# EAGLE design digital (EAGLE 7.6.0)
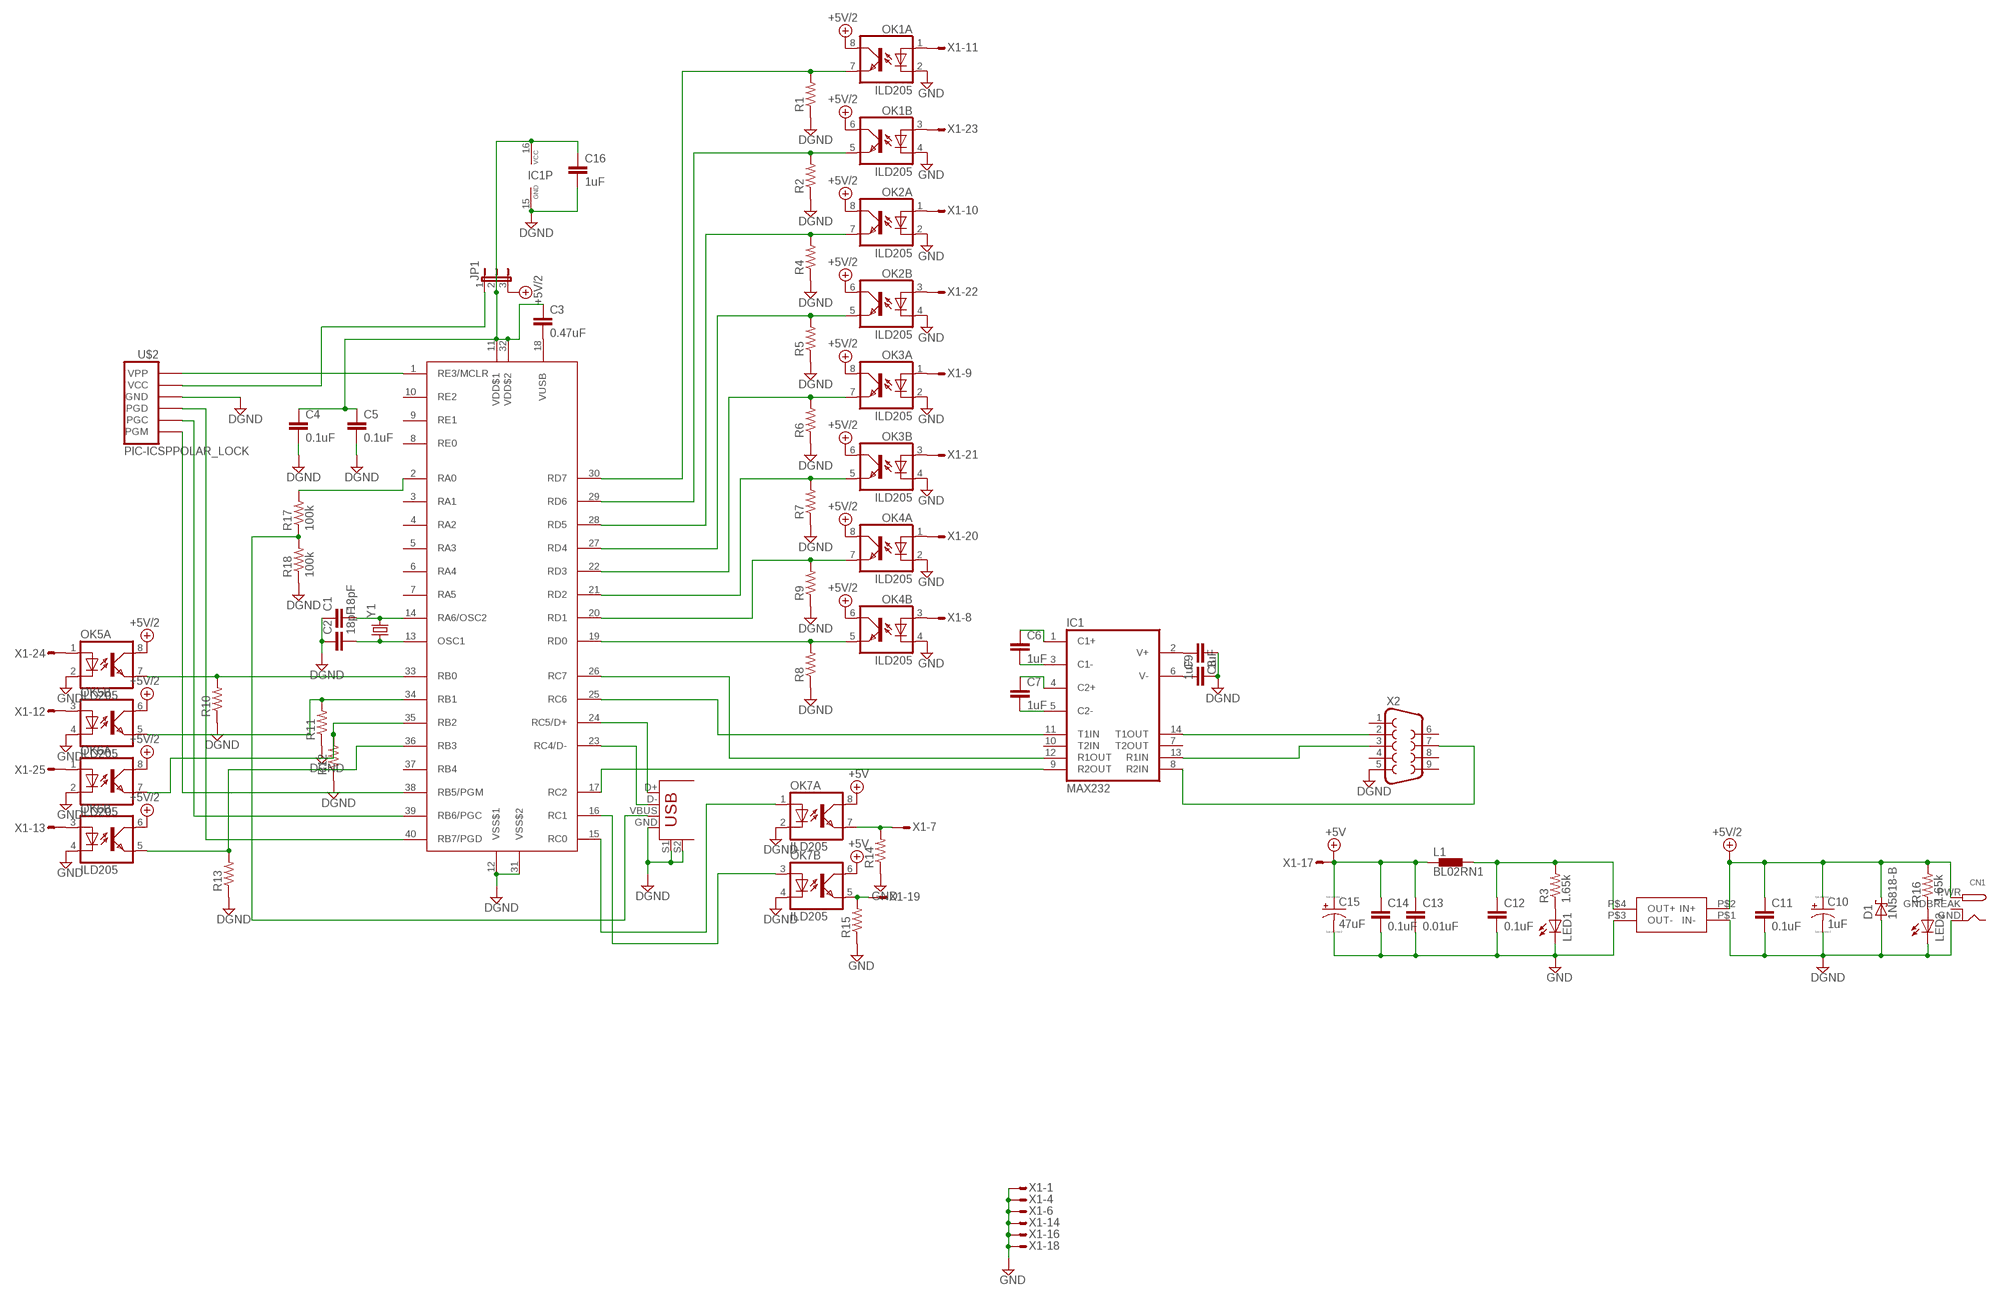
[diagram p0: schematic, sheet 1]

## Parts
C1  18pF  C-EU050-025X075  [C050-025X075]
C2  18pF  C-EU050-025X075  [C050-025X075]
C3  0.47uF  C-EU050-025X075  [C050-025X075]
C4  0.1uF  C-EU050-025X075  [C050-025X075]
C5  0.1uF  C-EU050-025X075  [C050-025X075]
C6  1uF  C-EU050-025X075  [C050-025X075]
C7  1uF  C-EU050-025X075  [C050-025X075]
C8  1uF  C-EU050-025X075  [C050-025X075]
C9  1uF  C-EU050-025X075  [C050-025X075]
C10  1uF  CPOL-USE5-8.5  [E5-8,5]
C11  0.1uF  C-EU050-025X075  [C050-025X075]
C12  0.1uF  C-EU050-025X075  [C050-025X075]
C13  0.01uF  C-EU050-025X075  [C050-025X075]
C14  0.1uF  C-EU050-025X075  [C050-025X075]
C15  47uF  CPOL-USE5-8.5  [E5-8,5]
C16  1uF  C-EU050-025X075  [C050-025X075]
CN1  DCBARRELPTH  [DCJACK_2MM_PTH]
D1  1N5818-B  [DO41-7.6]
IC1  MAX232  [DIL16]
J1  USB+SHIELD  [USB-B-PTH]
JP1  JP2E  [JP2]
L1  BL02RN1  [BL02RN1]
LED1  LED3MM  [LED3MM]
LED2  LED3MM  [LED3MM]
OK1  ILD205  [SOIC08]
OK2  ILD205  [SOIC08]
OK3  ILD205  [SOIC08]
OK4  ILD205  [SOIC08]
OK5  ILD205  [SOIC08]
OK6  ILD205  [SOIC08]
OK7  ILD205  [SOIC08]
R1  R-US_0204/2V  [0204V]
R2  R-US_0204/2V  [0204V]
R3  1.65k  R-US_0204/2V  [0204V]
R4  R-US_0204/2V  [0204V]
R5  R-US_0204/2V  [0204V]
R6  R-US_0204/2V  [0204V]
R7  R-US_0204/2V  [0204V]
R8  R-US_0204/2V  [0204V]
R9  R-US_0204/2V  [0204V]
R10  R-US_0204/2V  [0204V]
R11  R-US_0204/2V  [0204V]
R12  R-US_0204/2V  [0204V]
R13  R-US_0204/2V  [0204V]
R14  R-US_0204/2V  [0204V]
R15  R-US_0204/2V  [0204V]
R16  1.65k  R-US_0204/2V  [0204V]
R17  100k  R-US_0204/2V  [0204V]
R18  100k  R-US_0204/2V  [0204V]
U$1  PIC18F4458  [DIL40]
U$2  PIC-ICSPPOLAR_LOCK  [MOLEX-1X6_LOCK]
U$3  ROL-0505S  [SIP4]
X1  M25HS  [M25H]
X2  F09HP  [F09HP]
Y1  CRYSTALHC49US  [HC49US]

## Nets
+5V: C13.1 C14.1 C15.+ L1.1 OK7.6(B:COL) OK7.8(A:COL) X1.17
+5V/2: C10.+ C11.1 CN1.PWR D1.C JP1.3 OK1.6(B:COL) OK1.8(A:COL) OK2.6(B:COL) OK2.8(A:COL) OK3.6(B:COL) OK3.8(A:COL) OK4.6(B:COL) OK4.8(A:COL) OK5.6(B:COL) OK5.8(A:COL) OK6.6(B:COL) OK6.8(A:COL) R16.2 U$3.P$2(IN+)
DGND: C1.1 C2.1 C4.2 C5.2 C8.1 C9.2 C10.- C11.2 C16.2 CN1.GND D1.A IC1.15(GND) J1.GND J1.S1 J1.S2 LED2.K(C) OK7.2(A:C) OK7.4(B:C) R1.1 R2.1 R4.1 R5.1 R6.1 R7.1 R8.1 R9.1 R10.1 R11.1 R12.1 R13.1 R18.1 U$1.12(VSS$1) U$1.31(VSS$2) U$2.4(GND) U$3.P$1(IN-) X2.5
GND: C12.2 C13.2 C14.2 C15.- LED1.K(C) OK1.2(A:C) OK1.4(B:C) OK2.2(A:C) OK2.4(B:C) OK3.2(A:C) OK3.4(B:C) OK4.2(A:C) OK4.4(B:C) OK5.2(A:C) OK5.4(B:C) OK6.2(A:C) OK6.4(B:C) R14.1 R15.1 U$3.P$3(OUT-) X1.1 X1.4 X1.6 X1.14 X1.16 X1.18
N$1: C1.2 U$1.14(RA6/OSC2) Y1.2
N$2: C2.2 U$1.13(OSC1) Y1.1
N$3: IC1.8(R2IN) X2.7
N$4: IC1.9(R2OUT) U$1.17(RC2)
N$5: U$1.1(RE3/MCLR) U$2.6(VPP)
N$6: U$1.38(RB5/PGM) U$2.1(PGM)
N$7: U$1.39(RB6/PGC) U$2.2(PGC)
N$8: U$1.40(RB7/PGD) U$2.3(PGD)
N$9: C3.2 U$1.18(VUSB)
N$10: JP1.1 U$2.5(VCC)
N$11: OK1.1(A:A) X1.11
N$12: OK1.3(B:A) X1.23
N$13: OK2.1(A:A) X1.10
N$14: OK2.3(B:A) X1.22
N$15: OK1.7(A:EMIT) R1.2 U$1.30(RD7)
N$16: OK3.1(A:A) X1.9
N$17: OK3.3(B:A) X1.21
N$18: OK4.1(A:A) X1.20
N$19: OK4.3(B:A) X1.8
N$20: OK5.1(A:A) X1.24
N$21: OK5.3(B:A) X1.12
N$22: OK6.1(A:A) X1.25
N$23: OK6.3(B:A) X1.13
N$24: OK1.5(B:EMIT) R2.2 U$1.29(RD6)
N$25: OK2.7(A:EMIT) R4.2 U$1.28(RD5)
N$26: C12.1 L1.2 R3.2 U$3.P$4(OUT+)
N$27: OK2.5(B:EMIT) R5.2 U$1.27(RD4)
N$28: LED1.A R3.1
N$29: OK3.7(A:EMIT) R6.2 U$1.22(RD3)
N$30: OK3.5(B:EMIT) R7.2 U$1.21(RD2)
N$31: OK4.7(A:EMIT) R9.2 U$1.20(RD1)
N$32: OK4.5(B:EMIT) R8.2 U$1.19(RD0)
N$33: OK5.7(A:EMIT) R10.2 U$1.33(RB0)
N$34: OK5.5(B:EMIT) R11.2 U$1.34(RB1)
N$35: OK6.7(A:EMIT) R12.2 U$1.35(RB2)
N$36: OK6.5(B:EMIT) R13.2 U$1.36(RB3)
N$37: OK7.7(A:EMIT) R14.2 X1.7
N$38: OK7.5(B:EMIT) R15.2 X1.19
N$39: OK7.1(A:A) U$1.15(RC0)
N$40: OK7.3(B:A) U$1.16(RC1)
N$41: LED2.A R16.1
N$42: J1.VBUS R17.1 R18.2
N$44: IC1.11(T1IN) U$1.25(RC6)
N$45: C3.1 C4.1 C5.1 C16.1 IC1.16(VCC) JP1.2 U$1.11(VDD$1) U$1.32(VDD$2)
N$46: IC1.12(R1OUT) U$1.26(RC7)
N$47: C8.2 IC1.2(V+)
N$48: C9.1 IC1.6(V-)
N$49: C6.2 IC1.3(C1-)
N$50: C6.1 IC1.1(C1+)
N$51: C7.1 IC1.4(C2+)
N$52: C7.2 IC1.5(C2-)
N$53: IC1.13(R1IN) X2.3
N$54: IC1.14(T1OUT) X2.2
N$55: R17.2 U$1.2(RA0)
USB_N [USB]: J1.D- U$1.23(RC4/D-)
USB_P [USB]: J1.D+ U$1.24(RC5/D+)
Unconnected: IC1.7(T2OUT) IC1.10(T2IN) U$1.3(RA1) U$1.4(RA2) U$1.5(RA3) U$1.6(RA4) U$1.7(RA5) U$1.8(RE0) U$1.9(RE1) U$1.10(RE2) U$1.37(RB4) X1.2 X1.3 X1.5 X1.15 X2.1 X2.4 X2.6 X2.8 X2.9

## Power pins joined to a net without a drawn wire
GNDBREAK: CN1.GNDBREAK

## Library data of the parts
C1-C9 C11-C14 C16 = resistor:C-EU: CAPACITOR, European symbol
C10 C15 = resistor:CPOL-US: POLARIZED CAPACITOR, American symbol
CN1 = adafruit:DCBARREL: 2.0mm DC Barrel Jack DCJACK_2MM_PTH - Through Hole Jack (4UConnector: 05537)
D1 = diode:1N581*: 1.0A SCHOTTKY BARRIER RECTIFIER Source: http://www.diodes.com/datasheets/ds23001.pdf
IC1 = maxim:MAX232: RS232 TRANSCEIVER; MF: MAXIM; MPN: MAX232ACPE+; OC_FARNELL: 9723773; OC_NEWARK: 68K4544
J1 = SparkFun-Connectors:USB+SHIELD: USB+Shield USB connector with shield pins connectable
JP1 = jumper:JP2E: JUMPER
L1 = inductors:BL0: Noise Suppression Products/EMI Suppression Filters, Lead EMIFIL(R) Inductor Type Source: http://www.murata.com .. BL01RN1_DS.pdf
LED1 LED2 = led:LED: LED OSRAM: - CHIPLED LG R971, LG N971, LY N971, LG Q971, LY Q971, LO R971, LY R971 LH N974, LH R974 LS Q976, LO Q976, LY Q976 LO Q996 - Hyper CHIPLED LW Q18S LB Q993, LB Q99A, LB R99A - SideLED LS A670, LO A670, LY A670, LG A670, LP A670 LB A673, LV A673, LT A673, LW A673 LH A674 LY A675 LS A676, LA A676, LO A676, LY A676, LW A676 LS A679, LY A679, LG A679 - Hyper Micro SIDELED® LS Y876, LA Y876, LO Y876, LY Y876 LT Y87S - SmartLED LW L88C, LW L88S LB L89C, LB L89S, LG L890 LS L89K, LO L89K, LY L89K LS L896, LA L896, LO L896, LY L896 - TOPLED LS T670, LO T670, LY T670, LG T670, LP T670 LSG T670, LSP T670, LSY T670, LOP T670, LYG T670 LG T671, LOG T671, LSG T671 LB T673, LV T673, LT T673, LW T673 LH T674 LS T676, LA T676, LO T676, LY T676, LB T676, LH T676, LSB T676, LW T676 LB T67C, LV T67C, LT T67C, LS T67K, LO T67K, LY T67K, LW E67C LS E67B, LA E67B, LO E67B, LY E67B, LB E67C, LV E67C, LT E67C LW T67C LS T679, LY T679, LG T679 LS T770, LO T770, LY T770, LG T770, LP T770 LB T773, LV T773, LT T773, LW T773 LH T774 LS E675, LA E675, LY E675, LS T675 LS T776, LA T776, LO T776, LY T776, LB T776 LHGB T686 LT T68C, LB T68C - Hyper Mini TOPLED® LB M676 - Mini TOPLED Santana® LG M470 LS M47K, LO M47K, LY M47K Source: http://www.osram.convergy.de LUXEON: - LUMILED® LXK2-PW12-R00, LXK2-PW12-S00, LXK2-PW14-U00, LXK2-PW14-V00 LXK2-PM12-R00, LXK2-PM12-S00, LXK2-PM14-U00 LXK2-PE12-Q00, LXK2-PE12-R00, LXK2-PE12-S00, LXK2-PE14-T00, LXK2-PE14-U00 LXK2-PB12-K00, LXK2-PB12-L00, LXK2-PB12-M00, LXK2-PB14-N00, LXK2-PB14-P00, LXK2-PB14-Q00 LXK2-PR12-L00, LXK2-PR12-M00, LXK2-PR14-Q00, LXK2-PR14-R00 LXK2-PD12-Q00, LXK2-PD12-R00, LXK2-PD12-S00 LXK2-PH12-R00, LXK2-PH12-S00 LXK2-PL12-P00, LXK2-PL12-Q00, LXK2-PL12-R00 Source: www.luxeon.com KINGBRIGHT: KA-3528ASYC Source: www.kingbright.com
OK1-OK7 = optocoupler:ILD2*: Siemens ILD205/206/207/211/213/217 DUAL PHOTOTRANSISTOR SMALL OUTLINE SURFACE MOUNT OPTOCOUPLER Source: 153385-da-01-en-Optocoupler_ILD205-T.pdf; MF: VISHAY/TELEFUNKEN; MPN: ILD205T; OC_FARNELL: 1469512; OC_NEWARK: 20H8678
R1-R18 = resistor:R-US_: RESISTOR, American symbol
U$1 = PIC18:PIC18F4458
U$2 = SparkFun-Connectors:PIC-ICSP: ISCP Programming connector for UAV, UBW Kit, etc.
U$3 = modEEG:ROL-0505S
X1 = con-subd:M25?S: SUB-D; OC_FARNELL: unknown; OC_NEWARK: unknown
X2 = con-subd:F09: SUB-D; OC_FARNELL: unknown; OC_NEWARK: unknown
Y1 = SparkFun-FreqCtrl:CRYSTAL: Various standard crystals. Proven footprints.

## Net classes
1 USB: width 0.305 mm, clearance 0.254 mm

## Board
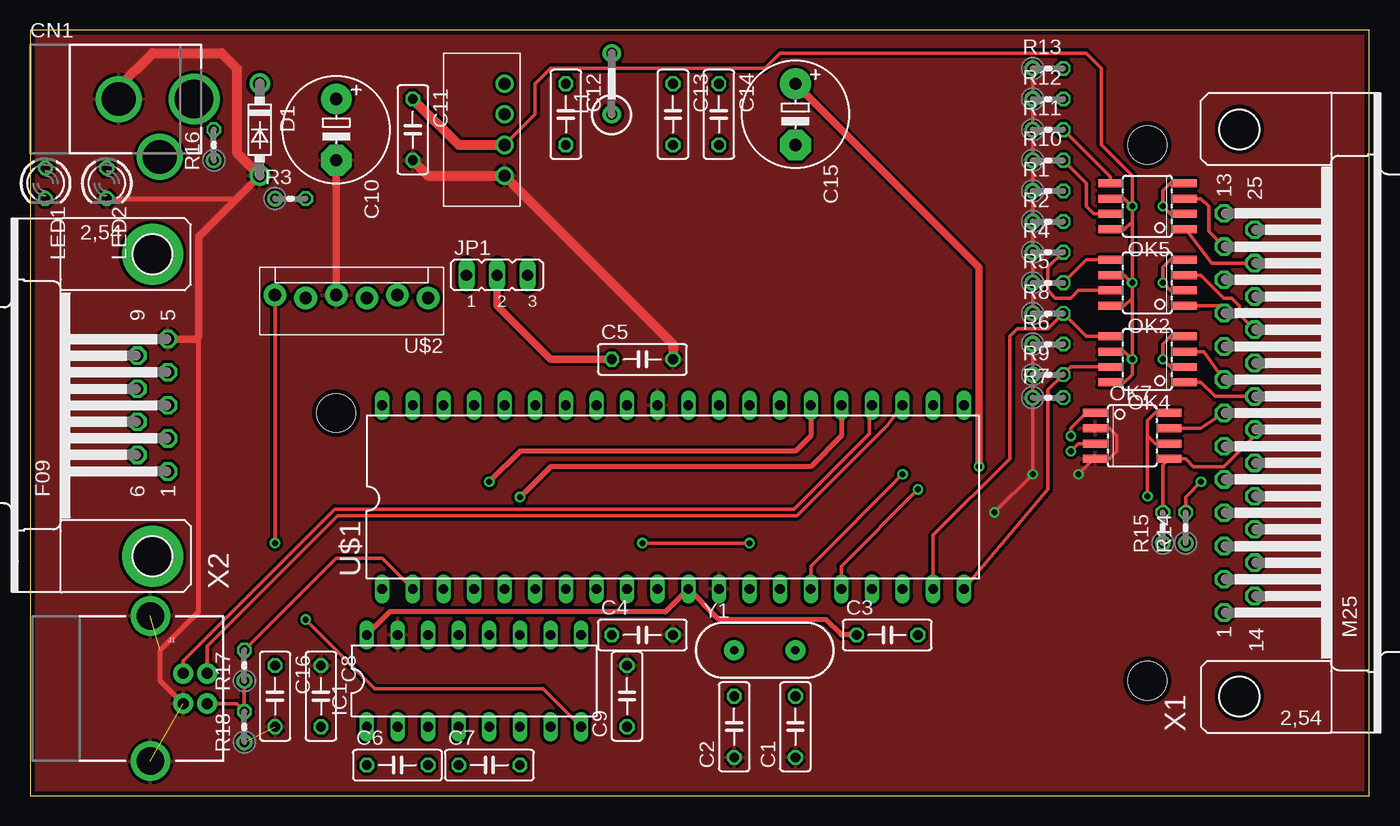
[diagram p1: board, top side]
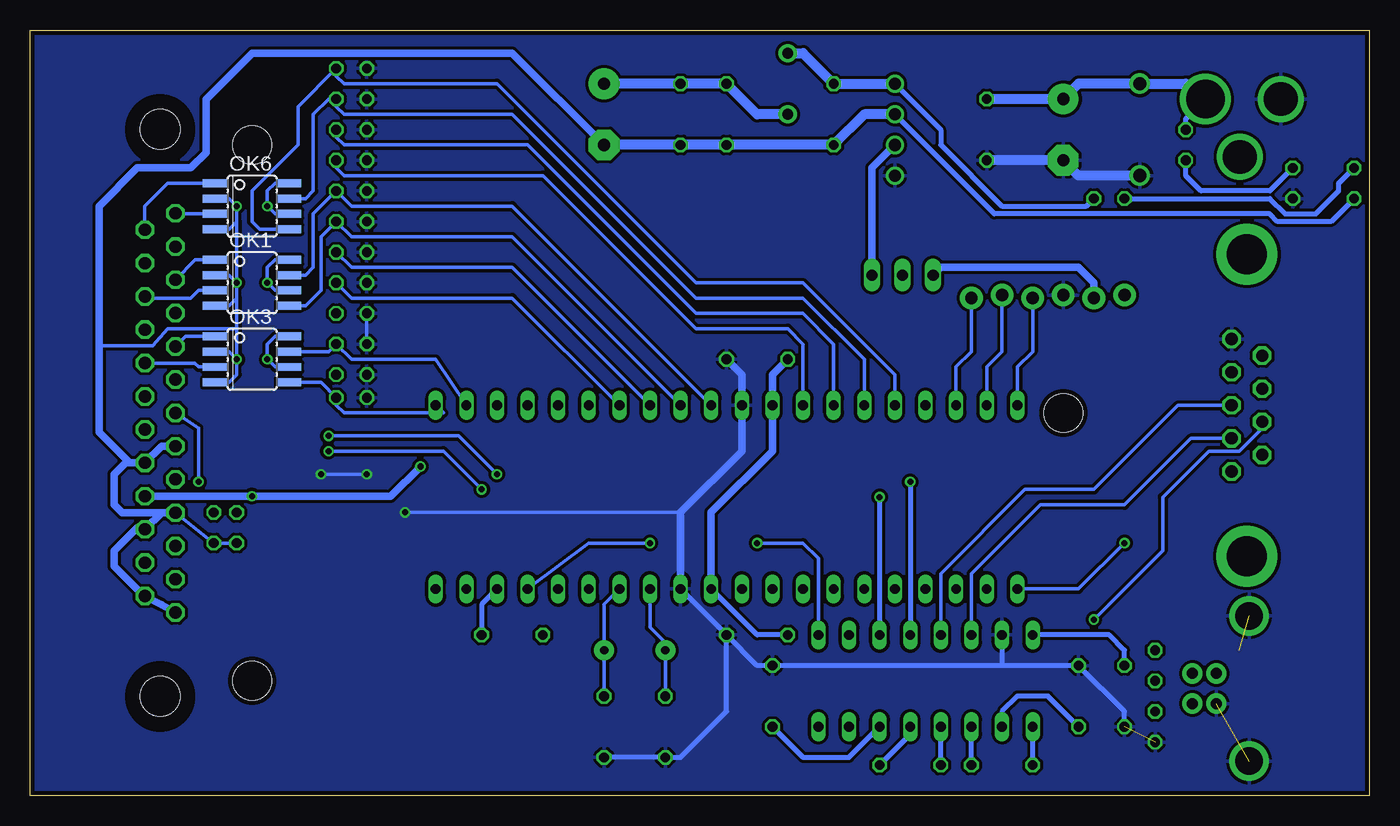
[diagram p2: board, bottom side, seen from below]

Size 111.12 x 63.5 mm. Coordinates in mm from the lower left corner, seen from the top.
Outline: 0,0 111.12,0 111.12,63.5 0,63.5 0,0
Copper layers (1*16): Top 0.0356mm / dielectric 1.5011mm / Bottom 0.0356mm
Design rules "Oshpark": minimum track width 6mil, minimum drill 13mil, track to track 6mil, track to pad 6mil, pad to pad 6mil, via to via 6mil, smd to smd 6mil, copper to edge 15mil, drill to drill 6mil, minimum pad ring 7mil, minimum via ring 7mil, stop-mask expansion 3mil, vias tented up to drill 0mil, thermal gap 10mil
Holes 3.2 mm at 92.71,53.98 92.71,9.53 25.4,31.75

### Footprints (pad centres in the part's own frame; a part is rotated, then mirrored left to right if it is on the bottom)
C050-025X075 = drill 0.813 octagon: 1 -2.54,0; 2 2.54,0
E5-8,5 = drill 1.016 pad 2.54: + -2.54,0 | drill 1.016 pad 2.54 octagon: - 2.54,0
DCJACK_2MM_PTH = drill 2.8: GND 0,7.35; GNDBREAK 4.8,10.75 | drill 3.2: PWR 0,13.6
DO41-7.6 = drill 1.1 pad 1.7: A 3.81,0; C -3.81,0
DIL16 = drill 0.813 long: 1 -8.89,-3.81; 2 -6.35,-3.81; 3 -3.81,-3.81; 4 -1.27,-3.81; 5 1.27,-3.81; 6 3.81,-3.81; 7 6.35,-3.81; 8 8.89,-3.81; 9 8.89,3.81; 10 6.35,3.81; 11 3.81,3.81; 12 1.27,3.81; 13 -1.27,3.81; 14 -3.81,3.81; 15 -6.35,3.81; 16 -8.89,3.81
USB-B-PTH = drill 0.914 pad 1.676: D+ 0,1.25; D- 1.981,1.25; GND 0,-1.25; VBUS 1.981,-1.25 | drill 2.286: S1 -2.718,-6.02; S2 -2.718,6.02
JP2 = drill 0.914 long: 1 -2.54,0; 2 0,0; 3 2.54,0
BL02RN1 = drill 0.9 pad 1.5: 1 -2.54,0; 2 2.54,0
LED3MM = drill 0.813 octagon: A -1.27,0; K 1.27,0
SOIC08 = smd 0.66 x 2.032: 1 -1.905,-3.073; 2 -0.635,-3.073; 3 0.635,-3.073; 4 1.905,-3.073; 5 1.905,3.073; 6 0.635,3.073; 7 -0.635,3.073; 8 -1.905,3.073
0204V = drill 0.813 octagon: 1 -1.27,0; 2 1.27,0
DIL40 = drill 0.813 long: 1 -24.13,-7.62; 2 -21.59,-7.62; 3 -19.05,-7.62; 4 -16.51,-7.62; 5 -13.97,-7.62; 6 -11.43,-7.62; 7 -8.89,-7.62; 8 -6.35,-7.62; 9 -3.81,-7.62; 10 -1.27,-7.62; 11 1.27,-7.62; 12 3.81,-7.62; 13 6.35,-7.62; 14 8.89,-7.62; 15 11.43,-7.62; 16 13.97,-7.62; 17 16.51,-7.62; 18 19.05,-7.62; 19 21.59,-7.62; 20 24.13,-7.62; 21 24.13,7.62; 22 21.59,7.62; 23 19.05,7.62; 24 16.51,7.62; 25 13.97,7.62; 26 11.43,7.62; 27 8.89,7.62; 28 6.35,7.62; 29 3.81,7.62; 30 1.27,7.62; 31 -1.27,7.62; 32 -3.81,7.62; 33 -6.35,7.62; 34 -8.89,7.62; 35 -11.43,7.62; 36 -13.97,7.62; 37 -16.51,7.62; 38 -19.05,7.62; 39 -21.59,7.62; 40 -24.13,7.62
MOLEX-1X6_LOCK = drill 1.016 pad 1.88: 1 0,0; 2 2.54,-0.254; 3 5.08,0; 4 7.62,-0.254; 5 10.16,0; 6 12.7,-0.254
SIP4 = drill 1: P$1 -3.81,-1.27; P$2 -1.27,-1.27; P$3 1.27,-1.27; P$4 3.81,-1.27
M25H = drill 1.016 octagon: 1 -16.561,1.27; 2 -13.792,1.27; 3 -11.049,1.27; 4 -8.28,1.27; 5 -5.512,1.27; 6 -2.769,1.27; 7 0,1.27; 8 2.769,1.27; 9 5.512,1.27; 10 8.28,1.27; 11 11.049,1.27; 12 13.792,1.27; 13 16.561,1.27; 14 -15.189,-1.27; 15 -12.421,-1.27; 16 -9.652,-1.27; 17 -6.909,-1.27; 18 -4.14,-1.27; 19 -1.372,-1.27; 20 1.372,-1.27; 21 4.14,-1.27; 22 6.909,-1.27; 23 9.652,-1.27; 24 12.421,-1.27; 25 15.189,-1.27 | hole 3.302: 23.52,0; -23.52,0
F09HP = drill 1.016 octagon: 1 -5.486,-1.27; 2 -2.743,-1.27; 3 0,-1.27; 4 2.743,-1.27; 5 5.486,-1.27; 6 -4.115,1.27; 7 -1.372,1.27; 8 1.372,1.27; 9 4.115,1.27 | drill 3.302 pad 5.08: G1 -12.522,0; G2 12.522,0
HC49US = drill 0.7 pad 1.651: 1 -2.54,0; 2 2.54,0

### Placement (x,y rotation side)
C1  63.5,5.71 90 top
C2  58.42,5.71 90 top
C3  71.12,13.34 0 top
C4  50.8,13.34 0 top
C5  50.8,36.2 0 top
C6  30.48,2.54 0 top
C7  38.1,2.54 0 top
C8  24.13,8.26 270 top
C9  49.53,8.26 90 top
C10  25.4,55.24 270 top
C11  31.75,55.24 270 top
C12  44.45,56.52 270 top
C13  53.34,56.52 270 top
C14  57.15,56.52 270 top
C15  63.5,56.52 270 top
C16  20.32,8.26 270 top
CN1  0,57.78 270 top
D1  19.05,55.24 270 top
IC1  36.83,9.53 0 top
J1  12.7,8.89 0 top
JP1  38.73,43.18 0 top
L1  48.26,59.05 90 top
LED1  1.27,50.8 270 top
LED2  6.35,50.8 270 top
OK1  92.71,42.55 270 bottom
OK2  92.71,42.55 90 top
OK3  92.71,36.2 270 bottom
OK4  92.71,36.2 90 top
OK5  92.71,48.9 90 top
OK6  92.71,48.9 270 bottom
OK7  91.44,29.84 270 top
R1  84.45,50.16 0 top
R2  84.45,47.62 0 top
R3  21.59,49.53 0 top
R4  84.45,45.09 0 top
R5  84.45,42.55 0 top
R6  84.45,37.47 0 top
R7  84.45,33.02 0 top
R8  84.45,40.01 0 top
R9  84.45,34.92 0 top
R10  84.45,52.7 0 top
R11  84.45,55.24 0 top
R12  84.45,57.78 0 top
R13  84.45,60.33 0 top
R14  95.89,22.23 90 top
R15  93.98,22.23 90 top
R16  15.24,53.98 90 top
R17  17.78,10.79 90 top
R18  17.78,5.71 90 top
U$1  53.34,24.77 0 top
U$2  33.02,41.27 180 top
U$3  38.1,55.24 90 top
X1  100.33,31.75 90 top
X2  10.16,32.38 90 top
Y1  60.96,12.06 0 top

### Tracks (layer width: path | path; a pad name or v marks a point on that pad's centre or on a via)
+5V  (via drill 0.5)
  Top 0.305: OK7.8 93.34,31.75 92.71,31.11 92.71,29.84 | 92.71,29.84 93.34,29.21 OK7.6 | 92.71,29.84 v92.71,24.84
  Top 0.61: v78.74,27.3 78.74,43.81 C15.+
  Bottom 0.61: X1.17 v92.71,24.84 81.2,24.84 v78.74,27.3
  Bottom 0.813: L1.1 50.8,56.52 C13.1 C14.1 C15.+
+5V/2  (via drill 0.5)
  Top 0.305: OK2.6 90.81,43.18 v91.44,42.55 | OK2.8 90.81,40.64 91.44,41.27 | 91.44,41.27 v91.44,42.55 | OK4.6 90.81,36.83 v91.44,36.2 | v91.44,36.2 91.44,34.92 90.81,34.29 OK4.8 88.9,34.29 | 91.44,41.27 v91.44,36.2 | OK5.6 90.81,49.53 v91.44,48.9 | OK5.8 90.81,46.99 91.44,47.62 | 91.44,47.62 v91.44,48.9 | 91.44,47.62 v91.44,42.55 | v91.44,48.9 91.44,51.44 88.9,53.98 88.9,60.33 87.63,61.59 62.23,61.59 60.96,60.33 43.18,60.33 41.91,59.05 41.91,56.52 U$3.P$2
  Top 0.813: C11.1 35.56,53.98 U$3.P$2
  Bottom 0.305: OK1.8 90.81,44.45 91.44,43.81 v91.44,42.55 90.81,41.91 OK1.6 | OK3.8 90.81,38.1 91.44,37.47 v91.44,36.2 90.81,35.56 OK3.6 | OK6.8 90.81,50.8 91.44,50.16 v91.44,48.9 90.81,48.26 OK6.6
  Bottom 0.406: R16.2 15.24,56.15 CN1.PWR
  Bottom 0.61: U$3.P$2 41.27,52.07 JP1.3
  Bottom 0.813: CN1.PWR 13.97,57.78 15.24,59.05 D1.C 24.13,59.05 C10.+ C11.1
DGND  (via drill 0.5)  (3 unrouted)
  Top 0.305: R8.1 R5.1 R4.1 R2.1 R1.1 R10.1 R11.1 R12.1 R13.1 | R6.1 R9.1 R7.1 v83.19,26.67 v80.01,23.5 | OK7.2 89.53,30.48 90.17,29.84 90.17,28.57 89.53,27.94 OK7.4 88.27,27.94 v87,26.67
  Top 0.406: J1.GND 12.68,7.64 10.79,9.53 10.79,12.06 13.97,15.24 13.97,38.1 | LED2.K 17.14,49.53
  Top 0.61: D1.A 17.14,49.53 13.97,46.35 13.97,38.1 13.74,37.87 X2.5 | U$2.4 C10.-
  Top 0.813: C11.2 33.02,51.44 U$3.P$1 53.34,37.47 C5.2 | CN1.GND 7.35,58.78 10.16,61.59 15.88,61.59 17.14,60.33 17.14,53.34 D1.A
  Bottom 0.305: R8.1 R6.1 | v80.01,23.5 57.15,23.5 | v87,26.67 v83.19,26.67
  Bottom 0.406: C1.1 C2.1 57.15,3.17 53.34,6.99 C4.2 | U$1.12 C4.2 | 30.48,10.79 C8.1 20.32,6.99 C16.2 | 30.48,10.79 C9.2 50.8,10.79 C4.2 | IC1.15 30.48,10.79
  Bottom 0.61: U$1.12 57.15,23.5 52.07,28.57 U$1.31 52.07,34.92 C5.2
  Bottom 0.813: D1.A 24.13,51.44 C10.- C11.2
  pour Bottom (isolate 0.254): -11.43,63.5 111.76,63.5 111.76,0 -11.43,0
  pour Top (isolate 0.254): 0,63.5 128.27,63.5 128.27,0 0,0
GND  (via drill 0.5)
  Top 0.305: OK2.4 94.61,44.45 93.98,43.81 v93.98,42.55 94.61,41.91 OK2.2 | OK4.4 94.61,38.1 93.98,37.47 v93.98,36.2 94.61,35.56 OK4.2 | OK5.4 94.61,50.8 93.98,50.16 v93.98,48.9 94.61,48.26 OK5.2
  Bottom 0.305: OK1.2 94.61,43.18 v93.98,42.55 | OK1.4 94.61,40.64 93.98,41.27 | 93.98,41.27 v93.98,42.55 | OK3.2 94.61,36.83 v93.98,36.2 | OK3.4 94.61,34.29 93.98,34.92 v93.98,36.2 | 93.98,41.27 93.98,38.73 | 93.98,38.73 v93.98,36.2 | 93.98,38.73 99.69,38.73 100.97,37.34 105.41,37.34 | OK6.2 94.61,49.53 v93.98,48.9 93.98,47.62 | OK6.4 94.61,46.99 93.98,47.62 | 93.98,47.62 v93.98,42.55 | R15.1 R14.1 95.91,20.95 X1.4
  Bottom 0.406: U$3.P$3 31.11,48.26 8.26,48.26 7.62,47.62 3.17,47.62 LED1.K
  Bottom 0.61: X1.1 100.23,15.82 X1.14 101.65,16.56 104.14,19.05 104.14,20.32 102.23,22.23 101.73,22.23 X1.16 100.23,23.47 | X1.4 100.23,23.47 | 100.23,23.47 103.48,23.47 104.14,24.13 104.14,26.67 103.2,27.61 102.87,27.61 | 102.87,27.61 X1.18 100.23,28.98 X1.6 | C15.- 71.12,61.59 92.71,61.59 96.52,57.78 96.52,53.34 97.79,52.07 102.23,52.07 105.41,48.9 105.41,37.34 105.41,30.15 102.87,27.61
  Bottom 0.813: C15.- C14.2 C13.2 C12.2 41.91,56.52 U$3.P$3
N$1
  Bottom 0.305: U$1.14 63.5,15.88 Y1.2 C1.2
N$2
  Bottom 0.305: U$1.13 59.69,13.97 58.42,12.7 Y1.1 C2.2
N$3  (via drill 0.5)
  Top 0.305: v22.86,14.61 28.57,8.89 42.55,8.89 IC1.8
  Bottom 0.305: X2.7 8.89,30.48 10.79,28.57 13.34,28.57 17.14,24.77 17.14,20.32 v22.86,14.61
N$4  (via drill 0.5)
  Top 0.305: v59.69,20.95 v50.8,20.95
  Bottom 0.305: U$1.17 64.77,20.95 v59.69,20.95 | v50.8,20.95 46.99,20.95 45.72,19.68 IC1.9
N$5  (via drill 0.5)
  Top 0.305: v20.32,20.95 U$2.6
  Bottom 0.305: U$1.1 24.13,17.14 v20.32,20.95
N$6
  Bottom 0.305: U$2.1 33.02,36.83 34.29,35.56 U$1.38
N$7
  Bottom 0.305: U$2.2 30.48,36.83 31.75,35.56 U$1.39
N$8
  Bottom 0.305: U$2.3 27.94,36.83 29.21,35.56 U$1.40
N$9
  Bottom 0.406: U$1.18 73.66,15.88 C3.2
N$10
  Bottom 0.61: U$2.5 22.86,42.55 24.13,43.81 35.56,43.81 JP1.1
N$11
  Bottom 0.305: OK1.1 97.41,44.45 X1.11
N$12
  Bottom 0.305: OK1.3 97.16,41.91 97.79,41.27 101.47,41.27 X1.23
N$13
  Top 0.305: OK2.1 99.03,40.64 X1.10
N$14
  Top 0.305: OK2.3 97.16,43.18 99.06,41.27 99.69,41.27 100.33,40.64 100.33,39.93 X1.22
N$15
  Bottom 0.305: U$1.30 71.12,48.9 84.45,48.9 R1.2 87.63,48.26 87.63,43.81 88.27,43.18 OK1.7
N$16
  Bottom 0.305: OK3.1 98.22,38.1 X1.9
N$17
  Bottom 0.305: OK3.3 97.16,35.56 97.48,35.89 X1.21
N$18
  Top 0.305: OK4.1 97.16,34.29 98.32,33.12 X1.20
N$19
  Top 0.305: OK4.3 97.38,36.83 X1.8
N$20
  Top 0.305: OK5.1 95.89,46.99 98.07,44.17 X1.24
N$21
  Top 0.305: OK5.3 97.16,49.53 97.79,48.9 97.79,46.81 X1.12
N$22
  Bottom 0.305: OK6.1 99.69,50.8 101.6,48.9 X1.25
N$23
  Bottom 0.305: OK6.3 98.37,48.26 X1.13
N$24
  Bottom 0.305: U$1.29 71.12,46.35 84.45,46.35 R2.2 87,46.35 87,41.91 88.27,40.64 OK1.5
N$25
  Top 0.305: OK2.7 87,41.91 86.36,41.27 85.09,41.27 84.45,41.91 84.45,43.81 R4.2
  Bottom 0.305: R4.2 84.45,43.81 71.12,43.81 U$1.28
N$26
  Bottom 0.406: U$3.P$4 35.56,55.24 35.56,53.98 30.48,48.9 23.5,48.9 R3.2
  Bottom 0.813: L1.2 46.99,61.59 C12.1 U$3.P$4
N$27
  Top 0.305: R5.2 87.63,44.45 OK2.5
  Bottom 0.305: R5.2 84.45,41.27 71.12,41.27 U$1.27
N$28
  Bottom 0.406: R3.1 8.26,49.53 6.99,48.26 4.45,48.26 2.54,50.16 2.54,50.8 LED1.A
N$29
  Bottom 0.305: OK3.7 86.36,36.83 R6.2 84.45,36.2 77.47,36.2 U$1.22
N$30
  Bottom 0.305: U$1.21 76.83,31.75 85.09,31.75 85.72,32.38 R7.2 87,34.29 OK3.5
N$31
  Top 0.305: U$1.20 84.45,25.4 84.45,33.66 R9.2 86.36,35.56 OK4.7
N$32
  Top 0.305: OK4.5 87.63,38.1 R8.2 84.45,38.73 81.92,38.73 81.28,38.1 81.28,27.94 74.93,21.59 U$1.19
N$33
  Top 0.305: OK5.7 88.27,48.26 87.63,48.9 87.63,50.8 R10.2
  Bottom 0.305: R10.2 85.72,52.07 85.09,51.44 68.58,51.44 55.88,38.73 48.26,38.73 46.99,37.47 U$1.33
N$34
  Top 0.305: OK5.5 89.64,51.33 R11.2
  Bottom 0.305: R11.2 85.72,54.61 85.09,53.98 69.85,53.98 55.88,40.01 46.99,40.01 44.45,37.47 U$1.34
N$35
  Bottom 0.305: U$1.35 41.91,36.2 46.99,41.27 55.88,41.27 71.12,56.52 85.09,56.52 85.72,57.15 R12.2 86.36,57.78 87.63,56.52 87.63,50.16 88.27,49.53 OK6.7
N$36
  Bottom 0.305: U$1.36 39.37,34.92 46.99,42.55 55.88,42.55 72.39,59.05 85.09,59.05 85.72,59.69 R13.2 88.9,57.15 88.9,53.98 92.71,50.16 92.71,47.62 92.08,46.99 OK6.5
N$37  (via drill 0.5)
  Top 0.305: OK7.7 97.16,30.48 X1.7 | R14.2 95.89,24.77 v97.16,26.04
  Bottom 0.305: v97.16,26.04 97.16,30.48 X1.7
N$38
  Top 0.305: X1.19 101.6,29.84 99.06,27.3 96.52,27.3 95.89,27.94 OK7.5 93.98,27.41 R15.2
N$39  (via drill 0.5)
  Top 0.305: OK7.1 87.63,31.75 86.36,30.48 v86.36,29.84 | v72.39,26.67 64.77,19.05 U$1.15
  Bottom 0.305: v86.36,29.84 75.56,29.84 v72.39,26.67
N$40  (via drill 0.5)
  Top 0.305: OK7.3 87,29.21 v86.36,28.57 | v73.66,25.4 67.31,19.05 U$1.16
  Bottom 0.305: v86.36,28.57 76.83,28.57 v73.66,25.4
N$41
  Bottom 0.406: LED2.A 8.26,50.16 13.97,50.16 15.24,51.44 R16.1
N$42
  Top 0.305: J1.VBUS 17.12,7.64 R18.2 R17.1
N$44  (via drill 0.5)
  Top 0.406: U$1.25 67.31,29.84 64.77,27.3 43.18,27.3 v40.64,24.77
  Bottom 0.406: v40.64,24.77 IC1.11
N$45
  Top 0.406: C3.1 67.31,13.34 66.04,14.61 57.15,14.61 U$1.11 52.7,15.24 29.84,15.24 IC1.16
  Top 0.61: JP1.2 38.73,40.64 43.18,36.2 C5.1
  Bottom 0.406: C4.1 50.8,13.34 U$1.11 | C16.1 20.32,12.06 21.59,13.34 IC1.16
  Bottom 0.61: U$1.11 54.61,23.5 49.53,28.57 U$1.32 49.53,34.92 C5.1
N$46  (via drill 0.5)
  Top 0.406: U$1.26 64.77,29.84 63.5,28.57 40.64,28.57 v38.1,26.04
  Bottom 0.406: v38.1,26.04 IC1.12
N$47
  Bottom 0.406: C8.2 26.67,8.26 29.21,8.26 30.48,6.99 IC1.2
N$48
  Bottom 0.406: C9.1 46.99,3.17 43.18,3.17 IC1.6
N$49
  Bottom 0.406: C6.2 IC1.3
N$50
  Bottom 0.406: C6.1 IC1.1
N$51
  Bottom 0.406: C7.1 IC1.4
N$52
  Bottom 0.406: IC1.5 38.1,5.08 C7.2
N$53
  Bottom 0.305: IC1.13 35.56,18.41 28.57,25.4 22.86,25.4 15.88,32.38 X2.3
N$54
  Bottom 0.305: X2.2 14.81,29.64 20.32,24.13 27.3,24.13 33.02,18.41 IC1.14
N$55
  Top 0.305: R17.2 25.4,19.68 29.21,19.68 U$1.2
USB_N
  Top 0.305: J1.D- 14.68,12.38 25.52,23.22 63.62,23.22 71.12,30.72 U$1.23
USB_P
  Top 0.305: J1.D+ 12.7,11.19 25.28,23.77 63.38,23.77 69.65,30.04 69.65,32.19 U$1.24